# Altium schematic sheet Digital_CPLD.SchDoc
size 381 x 381 mm
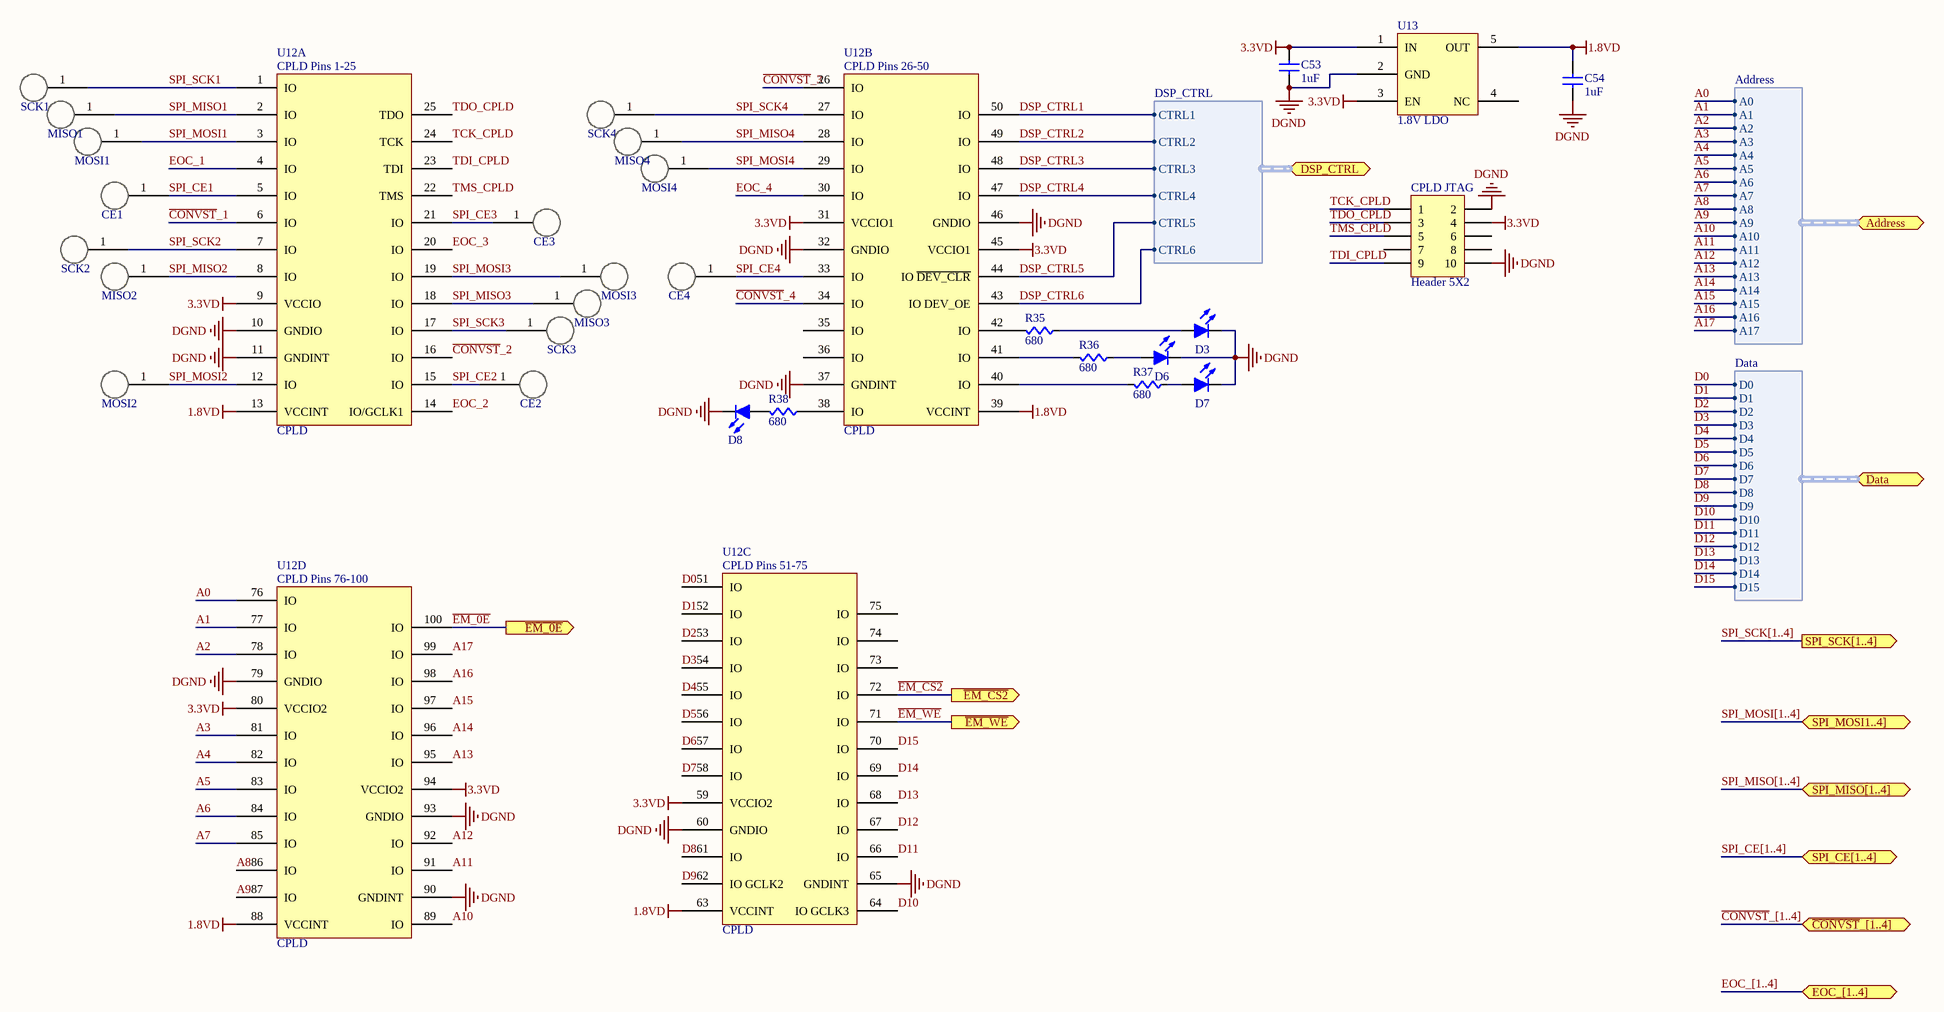
[diagram p0: Digital_CPLD.SchDoc]

## Parts
C53  value 1uF  [CAPC0603]  (hidden comment: Cap)
C54  value 1uF  [CAPC0603]  (hidden comment: Cap)
CE1  Test_Point  [TP]  (value not drawn)
CE2  Test_Point  [TP]  (value not drawn)
CE3  Test_Point  [TP]  (value not drawn)
CE4  Test_Point  [TP]  (value not drawn)
CPLD_JTAG  Header 5X2  [HDR2X5]
D3  LED-RED  [LED0805-RED]  (value not drawn)
D6  LED-RED  [LED0805-RED]  (value not drawn)
D7  LED-RED  [LED0805-RED]  (value not drawn)
D8  LED-RED  [LED0805-RED]  (value not drawn)
MISO1  Test_Point  [TP]  (value not drawn)
MISO2  Test_Point  [TP]  (value not drawn)
MISO3  Test_Point  [TP]  (value not drawn)
MISO4  Test_Point  [TP]  (value not drawn)
MOSI1  Test_Point  [TP]  (value not drawn)
MOSI2  Test_Point  [TP]  (value not drawn)
MOSI3  Test_Point  [TP]  (value not drawn)
MOSI4  Test_Point  [TP]  (value not drawn)
R35  value 680  [RES0603]  (hidden comment: Res)
R36  value 680  [RES0603]  (hidden comment: Res)
R37  value 680  [RES0603]  (hidden comment: Res)
R38  value 680  [RES0603]  (hidden comment: Res)
SCK1  Test_Point  [TP]  (value not drawn)
SCK2  Test_Point  [TP]  (value not drawn)
SCK3  Test_Point  [TP]  (value not drawn)
SCK4  Test_Point  [TP]  (value not drawn)
U12  CPLD  [TQFP-100]  (parts A,B,C,D of 4)
U13  1.8V LDO  [SOT23-5n]

## Ports
Address (harness Address), Data (harness Data), DSP_CTRL (harness DSP_CTRL), EOC_[1..4], SPI_CE[1..4] (bidir), SPI_MISO[1..4] (bidir), SPI_MOSI1..4], SPI_SCK[1..4] (out), ~{CONVST}_[1..4], ~{EM_0E} (out), ~{EM_CS2} (out), ~{EM_WE} (out)

## Harnesses
Address: A0, A1, A2, A3, A4, A5, A6, A7, A8, A9, A10, A11, A12, A13, A14, A15, A16, A17
Data: D0, D1, D2, D3, D4, D5, D6, D7, D8, D9, D10, D11, D12, D13, D14, D15
DSP_CTRL: CTRL1, CTRL2, CTRL3, CTRL4, CTRL5, CTRL6

## Nets
1.8VD: C54.1(A) U12.13(VCCINT) U12.39(VCCINT) U12.63(VCCINT) U12.88(VCCINT) U13.5(OUT)
3.3VD: C53.1(A) CPLD_JTAG.4 U12.9(VCCIO) U12.31(VCCIO1) U12.45(VCCIO1) U12.59(VCCIO2) U12.80(VCCIO2) U12.94(VCCIO2) U13.1(IN) U13.3(EN)
DGND: C53.2(B) C54.2(B) CPLD_JTAG.2 CPLD_JTAG.10 D3.1(K) D6.1(K) D7.1(K) D8.1(K) U12.10(GNDIO) U12.11(GNDINT) U12.32(GNDIO) U12.37(GNDINT) U12.46(GNDIO) U12.60(GNDIO) U12.65(GNDINT) U12.79(GNDIO) U12.90(GNDINT) U12.93(GNDIO) U13.2(GND)
A0: U12.76(IO) ; port Address.A0
A1: U12.77(IO) ; port Address.A1
A2: U12.78(IO) ; port Address.A2
A3: U12.81(IO) ; port Address.A3
A4: U12.82(IO) ; port Address.A4
A5: U12.83(IO) ; port Address.A5
A6: U12.84(IO) ; port Address.A6
A7: U12.85(IO) ; port Address.A7
A8: U12.86(IO) ; port Address.A8
A9: U12.87(IO) ; port Address.A9
A10: U12.89(IO) ; port Address.A10
A11: U12.91(IO) ; port Address.A11
A12: U12.92(IO) ; port Address.A12
A13: U12.95(IO) ; port Address.A13
A14: U12.96(IO) ; port Address.A14
A15: U12.97(IO) ; port Address.A15
A16: U12.98(IO) ; port Address.A16
A17: U12.99(IO) ; port Address.A17
~{CONVST}_1: U12.6(IO)
~{CONVST}_2: U12.16(IO)
~{CONVST}_3: U12.26(IO)
~{CONVST}_4: U12.34(IO)
D0: U12.51(IO) ; port Data.D0
D1: U12.52(IO) ; port Data.D1
D2: U12.53(IO) ; port Data.D2
D3: U12.54(IO) ; port Data.D3
D4: U12.55(IO) ; port Data.D4
D5: U12.56(IO) ; port Data.D5
D6: U12.57(IO) ; port Data.D6
D7: U12.58(IO) ; port Data.D7
D8: U12.61(IO) ; port Data.D8
D9: U12.62(IO_GCLK2) ; port Data.D9
D10: U12.64(IO_GCLK3) ; port Data.D10
D11: U12.66(IO) ; port Data.D11
D12: U12.67(IO) ; port Data.D12
D13: U12.68(IO) ; port Data.D13
D14: U12.69(IO) ; port Data.D14
D15: U12.70(IO) ; port Data.D15
DSP_CTRL1: U12.50(IO) ; port DSP_CTRL.CTRL1
DSP_CTRL2: U12.49(IO) ; port DSP_CTRL.CTRL2
DSP_CTRL3: U12.48(IO) ; port DSP_CTRL.CTRL3
DSP_CTRL4: U12.47(IO) ; port DSP_CTRL.CTRL4
DSP_CTRL5: U12.44(IO_~{DEV_CLR}) ; port DSP_CTRL.CTRL5
DSP_CTRL6: U12.43(IO_DEV_OE) ; port DSP_CTRL.CTRL6
~{EM_0E}: U12.100(IO) ; port ~{EM_0E}
~{EM_CS2}: U12.72(IO) ; port ~{EM_CS2}
~{EM_WE}: U12.71(IO) ; port ~{EM_WE}
EOC_1: U12.4(IO)
EOC_2: U12.14(IO/GCLK1)
EOC_3: U12.20(IO)
EOC_4: U12.30(IO)
SPI_CE1: CE1.1 U12.5(IO)
SPI_CE2: CE2.1 U12.15(IO)
SPI_CE3: CE3.1 U12.21(IO)
SPI_CE4: CE4.1 U12.33(IO)
SPI_MISO1: MISO1.1 U12.2(IO)
SPI_MISO2: MISO2.1 U12.8(IO)
SPI_MISO3: MISO3.1 U12.18(IO)
SPI_MISO4: MISO4.1 U12.28(IO)
SPI_MOSI1: MOSI1.1 U12.3(IO)
SPI_MOSI2: MOSI2.1 U12.12(IO)
SPI_MOSI3: MOSI3.1 U12.19(IO)
SPI_MOSI4: MOSI4.1 U12.29(IO)
SPI_SCK1: SCK1.1 U12.1(IO)
SPI_SCK2: SCK2.1 U12.7(IO)
SPI_SCK3: SCK3.1 U12.17(IO)
SPI_SCK4: SCK4.1 U12.27(IO)
TCK_CPLD: CPLD_JTAG.1 U12.24(TCK)
TDI_CPLD: CPLD_JTAG.9 U12.23(TDI)
TDO_CPLD: CPLD_JTAG.3 U12.25(TDO)
TMS_CPLD: CPLD_JTAG.5 U12.22(TMS)
NetD3_2: D3.2(A) R35.2(B)
NetD6_2: D6.2(A) R36.2(B)
NetD7_2: D7.2(A) R37.2(B)
NetD8_2: D8.2(A) R38.1(A)
NetR35_1: R35.1(A) U12.42(IO)
NetR36_1: R36.1(A) U12.41(IO)
NetR37_1: R37.1(A) U12.40(IO)
NetR38_2: R38.2(B) U12.38(IO)

Not connected (* = marked no-connect by the designer): CPLD_JTAG 6 7 8; U12 35(IO) 36(IO) 73(IO) 74(IO) 75(IO); U13 4(NC)

## Buses and harness runs
bus EOC_[1..4] = port EOC_[1..4]
bus SPI_CE[1..4] = port SPI_CE[1..4]
bus SPI_MISO[1..4] = port SPI_MISO[1..4]
bus SPI_MOSI[1..4] = port SPI_MOSI1..4]
bus SPI_SCK[1..4] = port SPI_SCK[1..4]
bus ~{CONVST}_[1..4] = port ~{CONVST}_[1..4]

## Notes on the sheet
- (in symbol EPM240GT100I5N, part A) CPLD Pins 1-25
- (in symbol EPM240GT100I5N, part B) CPLD Pins 26-50
- (in symbol EPM240GT100I5N, part C) CPLD Pins 51-75
- (in symbol EPM240GT100I5N, part D) CPLD Pins 76-100

## Library data of the parts
CE1-CE4 MISO1-MISO4 MOSI1-MOSI4 SCK1-SCK4 = Test_Point: TEST POINT PC COMPACT .063"D; Supplier 1: Digi-Key; Supplier Part Number 1: 5006K-ND
CPLD_JTAG = Header 5X2: Header, 5-Pin, Dual row; LatestRevisionDate: 17-Jul-2002; LatestRevisionNote: Re-released for DXP Platform.; Publisher: Altium Limited
D3 D6-D8 = LED-RED: Light Emitting Diode - RED; Manufacturer Part Number: LTST-C171CKT; Manufacturer: Lite-On Inc; Voltage - Forward (Vf) Typ: 1.8V; Current - Test: 20mA; Millicandela Rating: 25mcd; Viewing Angle: 130°; Color: Red; Supplier: Digi-Key; Package / Case: 0805 (2012 Metric); Supplier Part Number: 160-1421-1-ND
U12 = EPM240GT100I5N: IC CPLD 192MC 4.7NS 100TQFP; Supplier 1: Digi-Key; Supplier Part Number 1: 544-2275-ND
U13 = LP5907: IC REG LDO 1.8V 0.25A SOT23-5; Supplier 1: Digi-Key; Supplier Part Number 1: 296-41463-2-ND
C53 C54 = Cap: Supplier 1: Digi-Key; Supplier Part Number 1: 1276-1000-1-ND
R35-R38 = Res: Supplier 1: Digi-Key; Supplier Part Number 1: RMCF0603JT10K0CT-ND